# EAGLE design Shield_Play (EAGLE 9.4.0)
COMPANY: Unexpected Maker; DATE: 24-10-2018; DRAWN: Seon; REV: V1; TITLE: TinyPICO
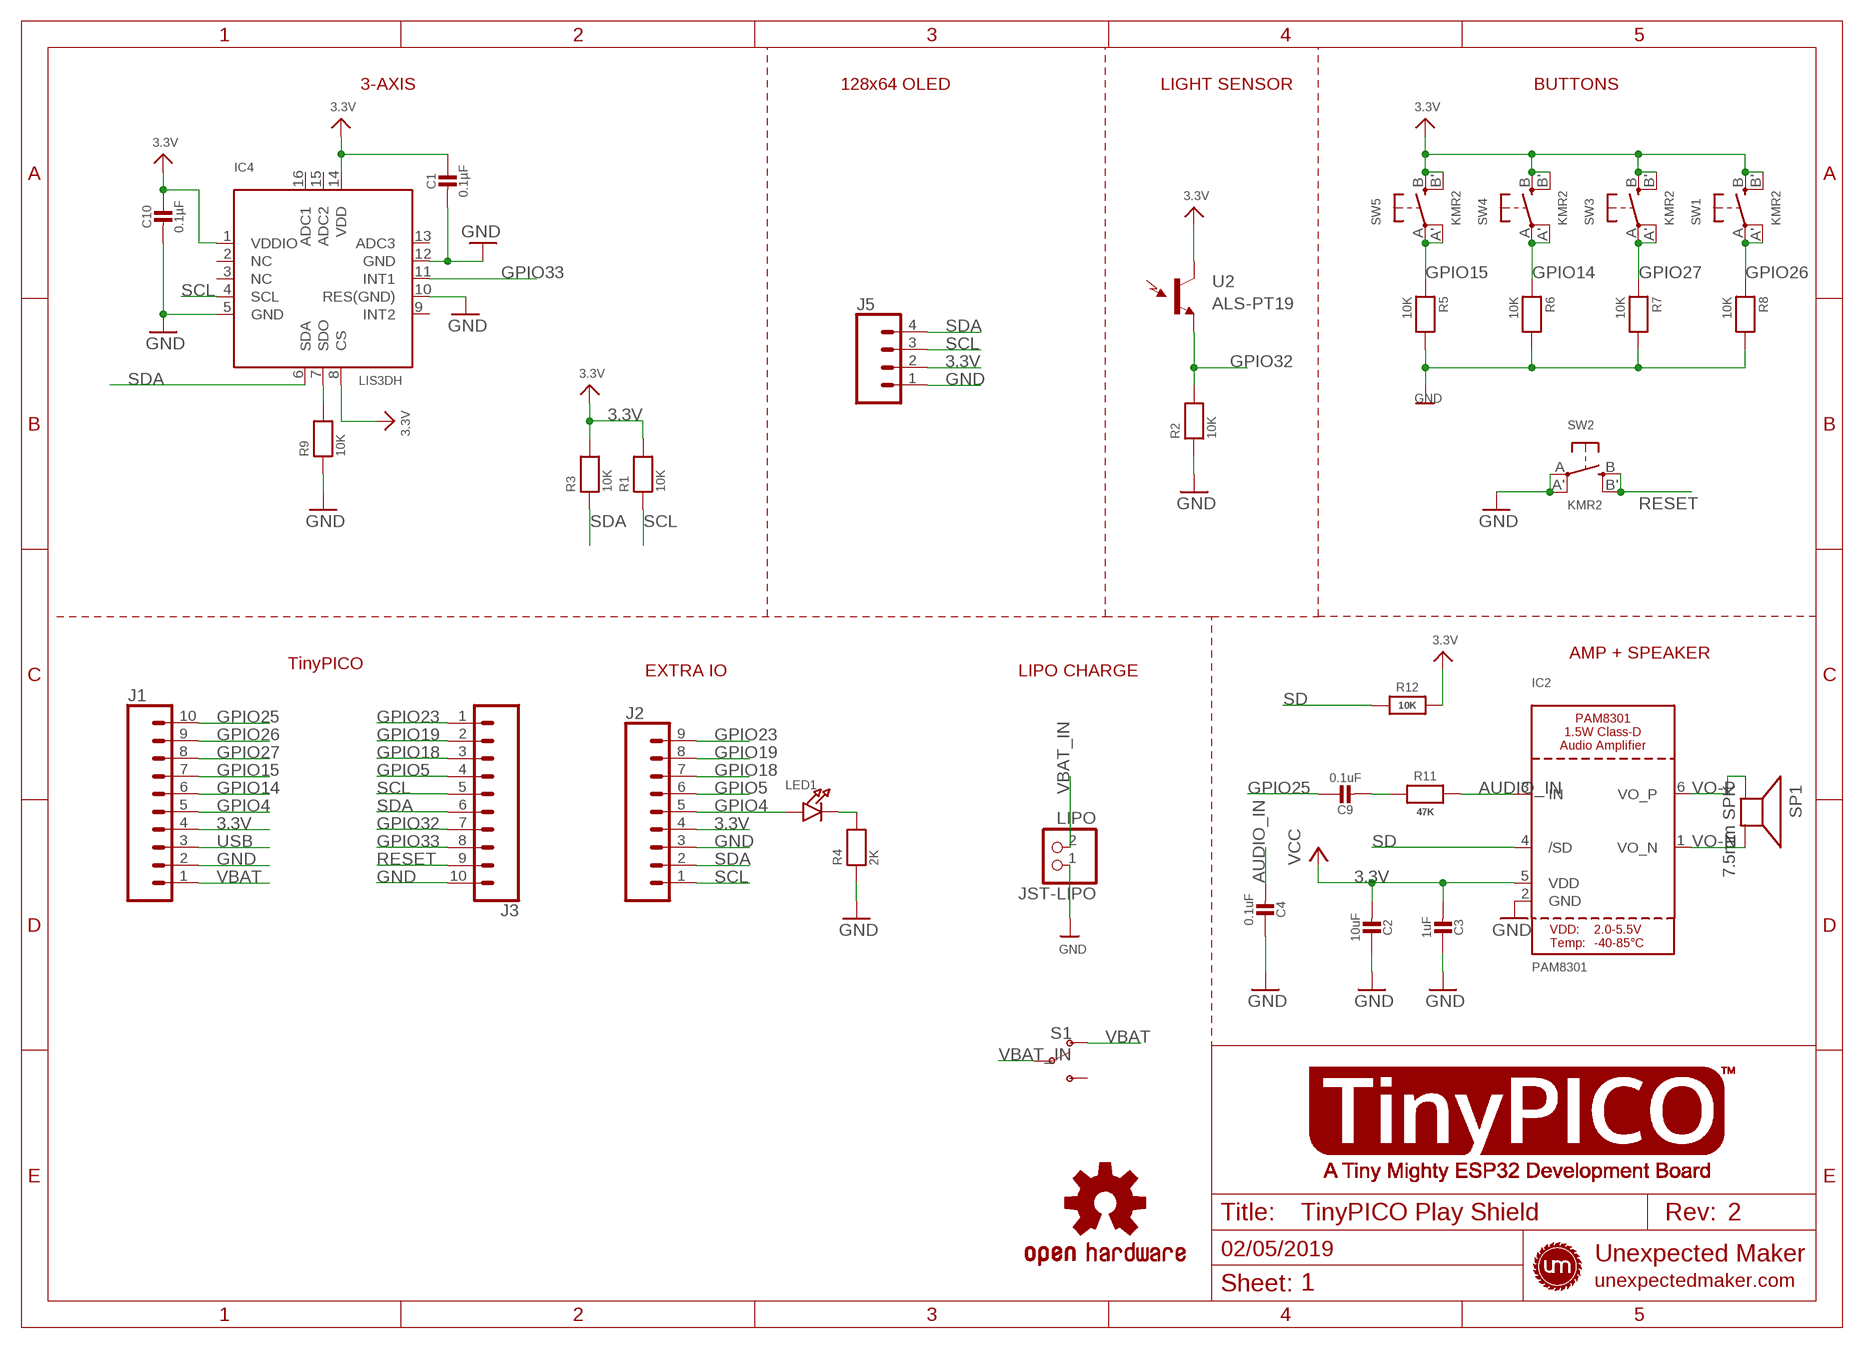
[diagram p0: schematic, sheet 1]
FRAME2 (FRAME_A4_TINYPICO): CDATE: 02/05/2019; REV: 2; SHEET_NUM: 1; TITLE: TinyPICO Play Shield

## Parts
C1  0.1µF  CAP_CERAMIC_0603MP  [_0603MP]
C2  10uF  CAP_CERAMIC_0603MP  [_0603MP]
C3  1uF  CAP_CERAMIC_0603MP  [_0603MP]
C4  0.1uF  CAP_CERAMIC_0603MP  [_0603MP]
C9  0.1uF  CAP_CERAMIC_0603MP  [_0603MP]
C10  0.1µF  CAP_CERAMIC_0603MP  [_0603MP]
IC2  PAM8301  [SOT23-6]
IC4  LIS3DH  ACCEL_LIS3DHTR  [LGA16_3X3MM]
J1  TINYPICO_HEADER_10NO_SILK_PTH_FEMALE  [1X10_NO_SILK]
J2  CONN_09NO_SILK  [1X09_NO_SILK]
J3  TINYPICO_HEADER_10NO_SILK_PTH_FEMALE  [1X10_NO_SILK]
J5  CONN_041X04_NO_SILK  [1X04_NO_SILK]
JST-LIPO  LIPO  JST_2PIN  [JSTPH2]
LED1  LED0603_NOOUTLINE  [CHIPLED_0603_NOOUTLINE]
LOGO1  OSHW-LOGOS  [OSHW-LOGO-S]
R1  10K  RESISTOR_0603MP  [_0603MP]
R2  10K  RESISTOR_0603MP  [_0603MP]
R3  10K  RESISTOR_0603MP  [_0603MP]
R4  2K  RESISTOR_0603MP  [_0603MP]
R5  10K  RESISTOR_0603MP  [_0603MP]
R6  10K  RESISTOR_0603MP  [_0603MP]
R7  10K  RESISTOR_0603MP  [_0603MP]
R8  10K  RESISTOR_0603MP  [_0603MP]
R9  10K  RESISTOR_0603MP  [_0603MP]
R11  47K  RESISTOR_0603MP  [_0603MP]
R12  10K  RESISTOR_0603MP  [_0603MP]
S1  SPARKFUN-SWITCHES_SWITCH-SPDT-SMD-RIGHT-ANGLE  [SPARKFUN-SWITCHES_SWITCH_SPST_SMD_A]
SP1  7.5mm SPK  SPEAKER_7.5MM  [BUZZER_SMT_7.5MM]
SW1  KMR2  SWITCH_TACT_SMT4.6X2.8  [BTN_KMR2_4.6X2.8]
SW2  KMR2  SWITCH_TACT_SMT4.6X2.8  [BTN_KMR2_4.6X2.8]
SW3  KMR2  SWITCH_TACT_SMT4.6X2.8  [BTN_KMR2_4.6X2.8]
SW4  KMR2  SWITCH_TACT_SMT4.6X2.8  [BTN_KMR2_4.6X2.8]
SW5  KMR2  SWITCH_TACT_SMT4.6X2.8  [BTN_KMR2_4.6X2.8]
U2  ALS-PT19  LIGHT_SENSORALS  [ALS-PT19]

## Nets
3.3V: C1.1 C2.2 C3.2 C10.1 IC2.5(VDD) IC4.1(VDDIO) IC4.8(CS) IC4.14(VDD) J1.4 J2.4 J5.2 R1.2 R3.2 R12.2 SW1.B'(S1) SW1.B(S) SW3.B'(S1) SW3.B(S) SW4.B'(S1) SW4.B(S) SW5.B'(S1) SW5.B(S) U2.C(C1) ; supply symbol labelled VCC
AUDIO_IN: C4.2 IC2.3(IN) R11.2
GND: C1.2 C2.1 C3.1 C4.1 C10.2 IC2.2(GND) IC4.5(GND) IC4.10(RES(GND)) IC4.12(GND) J1.2 J2.3 J3.10 J5.1 JST-LIPO.1 R2.1 R4.1 R5.2 R6.2 R7.2 R8.2 R9.1 SW2.A'(P1) SW2.A(P)
GPIO4: J1.5 J2.5 LED1.A
GPIO5: J2.6 J3.4
GPIO14: J1.6 R6.1 SW4.A'(P1) SW4.A(P)
GPIO15: J1.7 R5.1 SW5.A'(P1) SW5.A(P)
GPIO18: J2.7 J3.3
GPIO19: J2.8 J3.2
GPIO23: J2.9 J3.1
GPIO25: C9.1 J1.10
GPIO26: J1.9 R8.1 SW1.A'(P1) SW1.A(P)
GPIO27: J1.8 R7.1 SW3.A'(P1) SW3.A(P)
GPIO32: J3.7 R2.2 U2.E(E1)
GPIO33: IC4.11(INT1) J3.8
N$1: IC4.7(SDO) R9.2
N$2: LED1.C R4.2
N$6: C9.2 R11.1
RESET: J3.9 SW2.B'(S1) SW2.B(S)
SCL: IC4.4(SCL) J2.1 J3.5 J5.3 R1.1
SD: IC2.4(/SD) R12.1
SDA: IC4.6(SDA) J2.2 J3.6 J5.4 R3.1
USB: J1.3
VBAT: J1.1 S1.1(O)
VBAT_IN: JST-LIPO.2 S1.2(P)
VO-N: IC2.1(VO_N) SP1.-
VO-P: IC2.6(VO_P) SP1.+
Unconnected: IC4.2(NC) IC4.3(NC) IC4.9(INT2) IC4.13(ADC3) IC4.15(ADC2) IC4.16(ADC1) S1.3(S)

## Notes on the sheet
- 3-AXIS | 128x64 OLED | LIGHT SENSOR | BUTTONS
- AMP + SPEAKER
- TinyPICO
- EXTRA IO | LIPO CHARGE

## Library data of the parts
C1-C4 C9 C10 = microbuilder:CAP_CERAMIC: Ceramic Capacitors For new designs, use the packages preceded by an '_' character since they are more reliable: The following footprints should be used on most boards: _0402 - Standard footprint for regular board layouts _0603 - Standard footprint for regular board layouts _0805 - Standard footprint for regular board layouts _1206 - Standard footprint for regular board layouts For extremely tight-pitch boards where space is at a premium, the following 'micro-pitch' footprints can be used (smaller pads, no silkscreen outline, etc.): _0402MP - Micro-pitch footprint for very dense/compact boards _0603MP - Micro-pitch footprint for very dense/compact boards _0805MP - Micro-pitch footprint for very dense/compact boards _1206MP - Micro-pitch footprint for very dense/compact boards
IC2 = microbuilder:PAM8301
IC4 = microbuilder:ACCEL_LIS3DHTR: LIS3DHTR 3-Axis Accelerometer with I2C/SPI Interface VDD: 1.71-3.6V VDDIO: 1.71-VDD+0.1V Scale: +/-2g, 4g, 8g, 16g with 16--bit data output Temp:: -40°C - 85°C Mouser: 511-LIS3DHTR Digikey: 497-10613-1-ND
J1 J3 = UnexpectedMaker:TINYPICO_HEADER_10: Multi connection point. Often used as Generic Header-pin footprint for 0.1 inch spaced/style header connections On any of the 0.1 inch spaced packages, you can populate with these: Break Away Headers - Straight <https://www.sparkfun.com/products/116> (PRT-00116) Break Away Male Headers - Right Angle <https://www.sparkfun.com/products/553> (PRT-00553) Female Headers <https://www.sparkfun.com/products/115> (PRT-00115) Break Away Headers - Machine Pin <https://www.sparkfun.com/products/117> (PRT-00117) Break Away Female Headers - Swiss Machine Pin <https://www.sparkfun.com/products/743> (PRT-00743) Arduino Stackable Header - 10 Pin <https://www.sparkfun.com/products/11376> (PRT-11376) For SCREWTERMINALS and SPRING TERMINALS visit here: Screw Terimnals on SparkFun.com <https://www.sparkfun.com/search/results?term=Screw+Terminals> (5mm/3.5mm/2.54mm spacing) This device is also useful as a general connection point to wire up your design to another part of your project. Our various solder wires solder well into these plated through hole pads. Hook-Up Wire - Assortment (Stranded, 22 AWG) <https://www.sparkfun.com/products/11375> (PRT-11375) Hook-Up Wire - Assortment (Solid Core, 22 AWG) <https://www.sparkfun.com/products/11367> (PRT-11367) View the entire wire category on our website here <https://www.sparkfun.com/categories/141> Special notes: Molex polarized connector foot print use with SKU : PRT-08231 with associated crimp pins and housings. 1MM SMD Version SKU: PRT-10208 NOTES ON THE VARIANTS LOCK and LOCK_LONGPADS... This footprint was designed to help hold the alignment of a through-hole component (i.e. 6-pin header) while soldering it into place. You may notice that each hole has been shifted either up or down by 0.005 of an inch from it's more standard position (which is a perfectly straight line). This slight alteration caused the pins (the squares in the middle) to touch the edges of the holes. Because they are alternating, it causes a "brace" to hold the component in place. 0.005 has proven to be the perfect amount of "off-center" position when using our standard breakaway headers. Although looks a little odd when you look at the bare footprint, once you have a header in there, the alteration is very hard to notice. Also,if you push a header all the way into place, it is covered up entirely on the bottom side.; PROD_ID: CONN-11563
J2 = SparkFun-Connectors:CONN_09: Multi connection point. Often used as Generic Header-pin footprint for 0.1 inch spaced/style header connections On any of the 0.1 inch spaced packages, you can populate with these: Break Away Headers - Straight <https://www.sparkfun.com/products/116> (PRT-00116) Break Away Male Headers - Right Angle <https://www.sparkfun.com/products/553> (PRT-00553) Female Headers <https://www.sparkfun.com/products/115> (PRT-00115) Break Away Headers - Machine Pin <https://www.sparkfun.com/products/117> (PRT-00117) Break Away Female Headers - Swiss Machine Pin <https://www.sparkfun.com/products/743> (PRT-00743) For SCREWTERMINALS and SPRING TERMINALS visit here: Screw Terimnals on SparkFun.com <https://www.sparkfun.com/search/results?term=Screw+Terminals> (5mm/3.5mm/2.54mm spacing) This device is also useful as a general connection point to wire up your design to another part of your project. Our various solder wires solder well into these plated through hole pads. Hook-Up Wire - Assortment (Stranded, 22 AWG) <https://www.sparkfun.com/products/11375> (PRT-11375) Hook-Up Wire - Assortment (Solid Core, 22 AWG) <https://www.sparkfun.com/products/11367> (PRT-11367) View the entire wire category on our website here <https://www.sparkfun.com/categories/141> Special notes: Molex polarized connector foot print use with SKU : PRT-08231 with associated crimp pins and housings. 1MM SMD Version SKU: PRT-10208 NOTES ON THE VARIANTS LOCK and LOCK_LONGPADS... This footprint was designed to help hold the alignment of a through-hole component (i.e. 6-pin header) while soldering it into place. You may notice that each hole has been shifted either up or down by 0.005 of an inch from it's more standard position (which is a perfectly straight line). This slight alteration caused the pins (the squares in the middle) to touch the edges of the holes. Because they are alternating, it causes a "brace" to hold the component in place. 0.005 has proven to be the perfect amount of "off-center" position when using our standard breakaway headers. Although looks a little odd when you look at the bare footprint, once you have a header in there, the alteration is very hard to notice. Also,if you push a header all the way into place, it is covered up entirely on the bottom side.
J5 = SparkFun-Connectors:CONN_04: Multi connection point. Often used as Generic Header-pin footprint for 0.1 inch spaced/style header connections On any of the 0.1 inch spaced packages, you can populate with these: Break Away Headers - Straight <https://www.sparkfun.com/products/116> (PRT-00116) Break Away Male Headers - Right Angle <https://www.sparkfun.com/products/553> (PRT-00553) Female Headers <https://www.sparkfun.com/products/115> (PRT-00115) Break Away Headers - Machine Pin <https://www.sparkfun.com/products/117> (PRT-00117) Break Away Female Headers - Swiss Machine Pin <https://www.sparkfun.com/products/743> (PRT-00743) For SCREWTERMINALS and SPRING TERMINALS visit here: Screw Terimnals on SparkFun.com <https://www.sparkfun.com/search/results?term=Screw+Terminals> (5mm/3.5mm/2.54mm spacing) This device is also useful as a general connection point to wire up your design to another part of your project. Our various solder wires solder well into these plated through hole pads. Hook-Up Wire - Assortment (Stranded, 22 AWG) <https://www.sparkfun.com/products/11375> (PRT-11375) Hook-Up Wire - Assortment (Solid Core, 22 AWG) <https://www.sparkfun.com/products/11367> (PRT-11367) View the entire wire category on our website here <https://www.sparkfun.com/categories/141> Special notes: Molex polarized connector foot print use with SKU : PRT-08231 with associated crimp pins and housings. 1MM SMD Version SKU: PRT-10208; PROD_ID: CONN-09696
JST-LIPO = UnexpectedMaker:JST_2PIN: JST 2-Pin Right-Angle Connector PH-Series - 4UConnector: 17311 SH-Series - 4UConnector: 07278
LED1 = microbuilder:LED: LED 0603 - 0603 Surface Mount Package 2mA: Green LED - Low Power (3.9mcd, 2ma, 1.7Vf) - Digikey: 475-2709-2-ND Orange LED - Low Power (9.8mcd, 2ma, 1.8Vf) - Digikey: 475-1194-2-ND Red LED - Low Power (5mcd, 2ma, 1.8Vf) - Digikey: 475-1195-2-ND Yellow LED - Low Power (7mcd, 2ma, 1.8Vf) - Digikey: 475-1196-2-ND 5mA: Blue LED - Low Power (17mcd, 5ma, 2.9Vf) - Digikey: LNJ937W8CRACT-ND 0805 - 0805 Surface Mount Package 2mA: Red LED (8.8mcd, 2mA, 1.8Vf, Clear) - Low Power [Digikey: 475-2510-1-ND] Green LED (5mcd, 2mA, 1.8Vf, Clear) - Low Power [Digikey: 475-2730-1-ND] Yellow LED (11.3mcd, 2mA, 1.8Vf, Clear) - Low Power [Digikey: 475-2555-1-ND] 20mA: Red LED (104mcd, 20mA, Diffused) - LS R976 [Digikey: 475-1278-6-ND] Red LED (12mcd, 20mA, 2.0Vf, Clear) - APT2012EC [Digikey: 754-1128-1-ND] Green LED (15mcd, 20mA, 2.2Vf, Clear) - APT2012GC [Digikey: 754-1131-1-ND] Orange LED (160mcd, 20mA, 2.1Vf, Clear) - APT2012SECK [Digikey: 754-1130-1-ND] 1206 - 1206 Surface Mount Package Green LED (26mcd, 20mA, Diffused) - LG N971 [Digikey: 475-1407-6-ND] Red LED (15mcd, 20mA, Diffused) - LH N974 [Digikey: 475-1416-6-ND]
LOGO1 = SparkFun-Aesthetics:OSHW-LOGO: Open-Source Hardware (OSHW) Logo This logo indicates the piece of hardware it is found on incorporates a OSHW license and/or adheres to the definition of open source hardware found here: http://freedomdefined.org/OSHW
R1-R9 R11 R12 = microbuilder:RESISTOR: Resistors For new designs, use the packages preceded by an '_' character since they are more reliable: The following footprints should be used on most boards: _0402 - Standard footprint for regular board layouts _0603 - Standard footprint for regular board layouts _0805 - Standard footprint for regular board layouts _1206 - Standard footprint for regular board layouts For extremely tight-pitch boards where space is at a premium, the following 'micro-pitch' footprints can be used (smaller pads, no silkscreen outline, etc.): _0402MP - Micro-pitch footprint for very dense/compact boards _0603MP - Micro-pitch footprint for very dense/compact boards _0805MP - Micro-pitch footprint for very dense/compact boards _1206MP - Micro-pitch footprint for very dense/compact boards
S1 = UM_Badge:SPARKFUN-SWITCHES_SWITCH-SPDT: Single Pole, Double Throw (SPDT) Switch Single-pole, double-throw (SPDT) switch. Variant Overview SMD-AYZ0202 Surface Mount DPDT Switch <https://www.sparkfun.com/products/597> (COM-00597) Used on e.g. LilyPad Arduino USB - ATmega32U4 Board <https://www.sparkfun.com/products/12049> PTH-11.6X4.0MM SPDT Mini Power Switch <https://www.sparkfun.com/products/102> (COM-00102) Used on e.g. SparkFun Simon Says - Through-Hole Soldering Kit <https://www.sparkfun.com/products/10547> (KIT-10547) PTH-11.6X4.0MM-KIT KIT version of SPDT Mini Power Switch - Simplifies soldering by removing tStop of switch pins - only one side can be soldered. PTH-11.6X4.0MM-LOCK LOCK version of SPDT Mini Power Switch - Offset pins hold switch in place for easier soldering. SMD-RIGHT-ANGLE Surface Mount Right Angle Switch <https://www.sparkfun.com/products/10860> (COM-10860) Used on e.g. SparkFun ESP8266 Thing <https://www.sparkfun.com/products/13231>; PROD_ID: SWCH-10651; SF_SKU: COM-10860
SP1 = microbuilder:SPEAKER: SPEAKER Source: Buerklin Added PS12 (for part # PS1240 piezo) http://www.ladyada.net/library/pcb/eaglelibrary.html
SW1-SW5 = microbuilder:SWITCH_TACT_SMT: SMT Tact Switches 6x6mm - Digikey: P12940SCT-ND KMR2 (4.6x2.8mm) - Digikey: 401-1426-1-ND EVQ-PQHB55 - Light Touch, 160GF (4.5x4.5mm) - Digikey: P8090SCT-ND KMT0 - KMT021 NGJ LHS (etc.) IP68/Waterproof - Digikey: CKN10289CT-ND
U2 = SparkFun-Sensors:LIGHT_SENSOR: Ambient Light Sensors - Phototransistors Low cost ambient light sensors, consisting of a phototransistor in miniature SMD packages. Output voltage varies with light intensity. SparkFun Products ALS-PT19 Light Sensor <https://www.sparkfun.com/products/12566> (SEN-12566) Ambient Light Sensor - TEMT6000 <https://www.sparkfun.com/products/8348> (SEN-08348) SparkFun Ambient Light Sensor Breakout - TEMT60000 <https://www.sparkfun.com/products/8688> (SEN-08688); PROD_ID: IC-11836; SF_ID: SEN-12566

## Net classes
1 power: width 0.305 mm

## Board
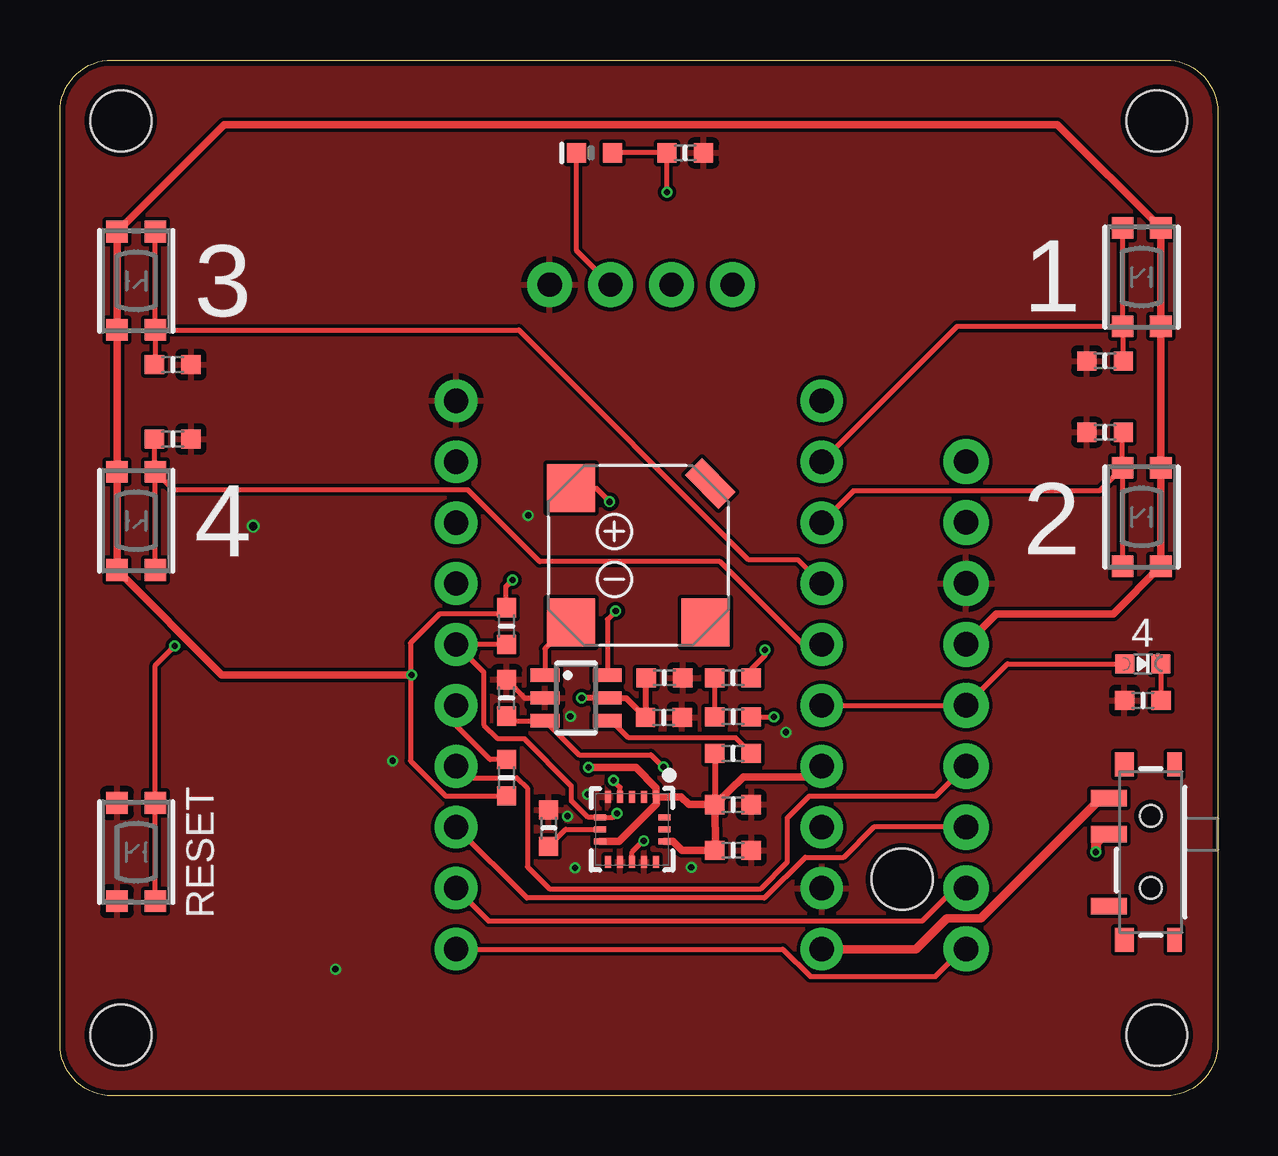
[diagram p1: board, top side]
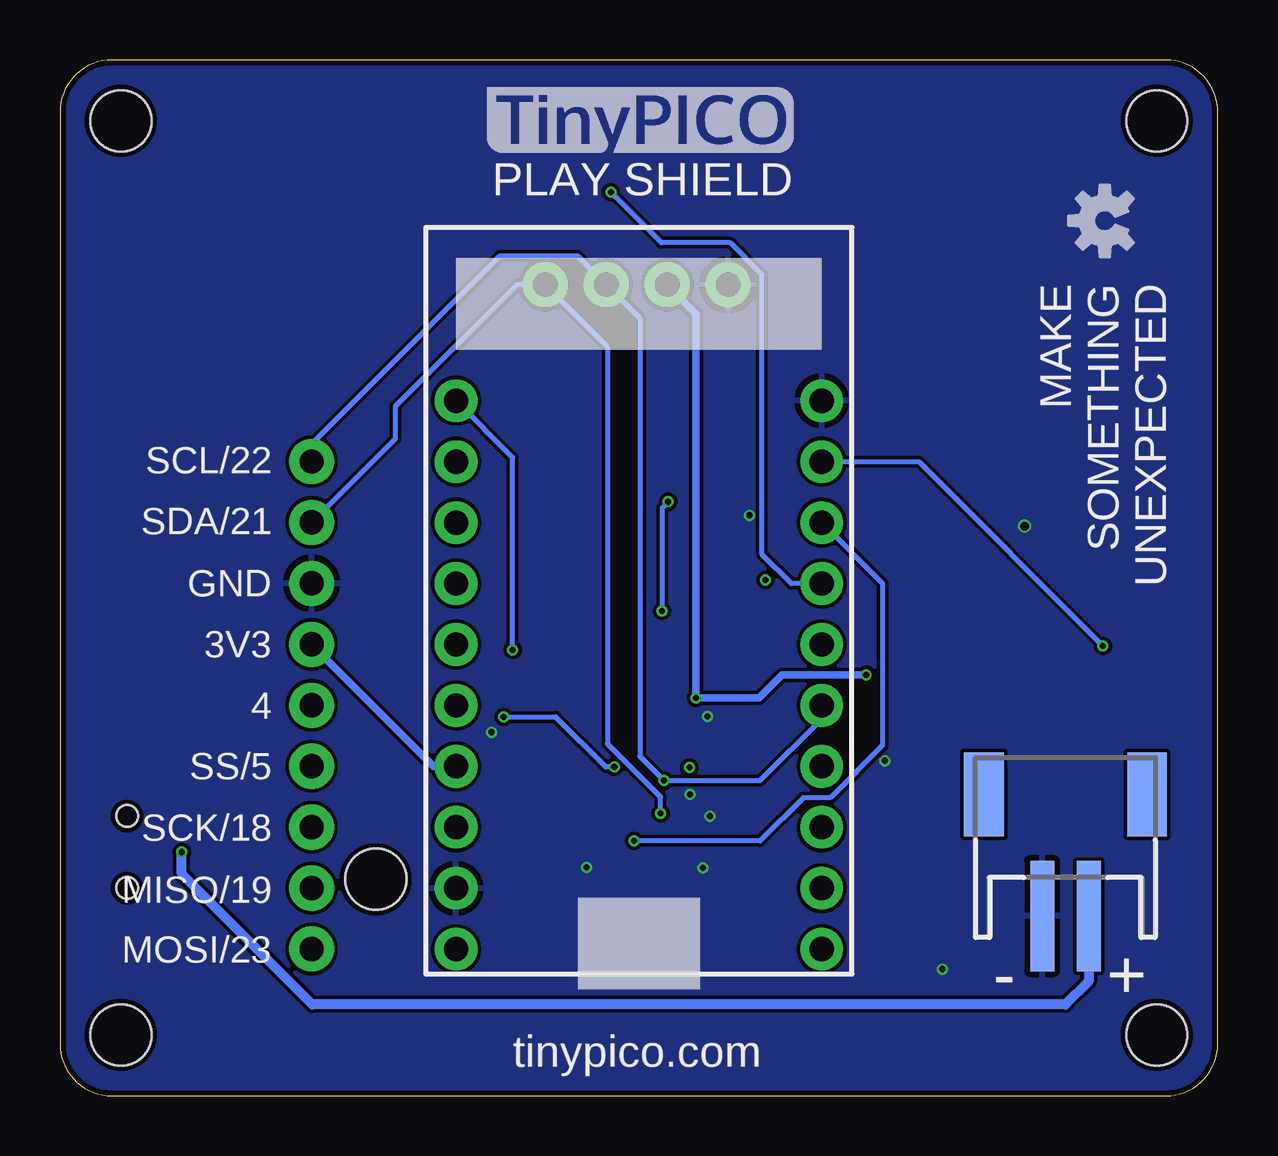
[diagram p2: board, bottom side, seen from below]

Size 48.26 x 43.18 mm. Coordinates in mm from the lower left corner, seen from the top.
Outline: 48.26,41.01 48.26,2.17 arc-90 46.09,0 2.17,0 arc-90 0,2.17 0,41.01 arc-90 2.17,43.18 46.09,43.18 arc-90 48.26,41.01
Copper layers (1*16): Top 0.035mm / dielectric 1.5mm / Bottom 0.035mm
Design rules "UnexpectedMaker_JLCPCB 2 Layer": minimum track width 6mil, minimum drill 10mil, track to track 6mil, track to pad 6mil, pad to pad 6mil, via to via 6mil, smd to smd 6mil, copper to edge 9mil, drill to drill 7mil, minimum pad ring 4mil, minimum via ring 4mil, stop-mask expansion 4mil, vias tented up to drill 25mil, thermal gap 10mil
Holes 2.54 mm at 45.72,2.54 2.54,2.54 2.54,40.64 45.72,40.64 35.1,9.03

### Footprints (pad centres in the part's own frame; a part is rotated, then mirrored left to right if it is on the bottom)
_0603MP = smd 0.8 x 0.8: 1 -0.762,0; 2 0.762,0
SOT23-6 = smd 0.55 x 1.2: 1 -0.95,-1.3; 2 0,-1.3; 3 0.95,-1.3; 4 0.95,1.3; 5 0,1.3; 6 -0.95,1.3
LGA16_3X3MM = smd 0.5 x 0.25: 1 -1.35,1; 2 -1.35,0.5; 3 -1.35,0; 4 -1.35,-0.5; 5 -1.35,-1; 9 1.35,-1; 10 1.35,-0.5; 11 1.35,0; 12 1.35,0.5; 13 1.35,1 | smd 0.25 x 0.5: 6 -0.5,-1.35; 7 0,-1.35; 8 0.5,-1.35; 14 0.5,1.35; 15 0,1.35; 16 -0.5,1.35
1X10_NO_SILK = drill 1.016 pad 1.778: 1 0,0; 2 2.54,0; 3 5.08,0; 4 7.62,0; 5 10.16,0; 6 12.7,0; 7 15.24,0; 8 17.78,0; 9 20.32,0; 10 22.86,0
1X09_NO_SILK = drill 1.016 pad 1.88: 1 0,0; 2 2.54,0; 3 5.08,0; 4 7.62,0; 5 10.16,0; 6 12.7,0; 7 15.24,0; 8 17.78,0; 9 20.32,0
1X04_NO_SILK = drill 1.016 pad 1.88: 1 0,0; 2 2.54,0; 3 5.08,0; 4 7.62,0
JSTPH2 = smd 1 x 4.6: 1 -0.965,-3.607; 2 0.965,-3.607 | smd 1.651 x 3.505: NC1 -3.4,1.473; NC2 3.4,1.473
CHIPLED_0603_NOOUTLINE = smd 0.8 x 0.8: A 0,-0.75; C 0,0.75
SPARKFUN-SWITCHES_SWITCH_SPST_SMD_A = smd 0.7 x 1.5: 1 -2.25,-1.75; 2 -0.75,-1.75; 3 2.25,-1.75 | smd 1 x 0.6: GND1 -3.65,1; GND3 3.65,1 | smd 1 x 0.8: GND2 -3.65,-1.1; GND4 3.65,-1.1 | hole 0.9: -1.5,0; 1.5,0
BUZZER_SMT_7.5MM = smd 2 x 2: + 2.8,-2.8; - 2.8,2.8; MT2 -2.8,2.8 | smd 2 x 1 rotated 135: MT -3,-3
BTN_KMR2_4.6X2.8 = smd 0.9 x 0.9: A 2.05,0.8; A' -2.05,0.8; B 2.05,-0.8; B' -2.05,-0.8
ALS-PT19 = smd 0.8 x 0.8: C -0.75,0; E 0.75,0

### Placement (x,y rotation side)
C1  28.05,12.14 0 top
C2  25.2,17.42 180 top
C3  25.17,15.77 180 top
C4  18.62,16.59 270 top
C9  28.05,17.42 180 top
C10  28.05,10.24 0 top
IC2  21.51,16.59 270 top
IC4  23.85,11.11 270 top
J1  31.75,6.12 90 top
J2  37.77,26.44 270 top
J3  16.51,6.12 90 top
J5  20.41,33.81 0 top
JST-LIPO  6.35,11.1 0 bottom
LED1  45.14,18.01 270 top
LOGO1  4.71,36.48 90 bottom
R1  18.62,13.26 270 top
R2  26.06,39.31 180 top
R3  18.62,19.58 90 top
R4  45.14,16.48 0 top
R5  4.7,30.48 0 top
R6  4.7,27.38 0 top
R7  43.56,27.66 180 top
R8  43.56,30.63 180 top
R9  20.37,11.16 270 top
R11  28.05,15.8 0 top
R12  28.05,14.27 180 top
S1  45.47,10.16 270 top
SP1  24.1,22.53 180 top
SW1  45.09,34.13 90 top
SW2  3.17,10.16 90 top
SW3  45.09,24.13 90 top
SW4  3.17,23.97 270 top
SW5  3.17,33.97 270 top
U2  22.28,39.31 0 top

### Tracks (layer width: path | path; a pad name or v marks a point on that pad's centre or on a via)
3.3V  (via drill 0.25)
  Top 0.203: J5.2 21.53,35.23 U2.C | R1.2 16.08,12.5 14.61,13.97 14.61,17.55 14.61,18.87 15.82,20.09 18.33,20.09 R3.2 18.59,21.24 v18.86,21.5
  Top 0.254: v21.75,16.59 IC2.5 23.6,16.59 C3.2 24.41,17.4 C2.2 | R12.2 C1.1
  Top 0.305: IC4.14 25.56,10.61 25.93,10.24 C10.1 27.32,10.26 C1.1 | IC4.1 25.89,12.47 26.23,12.14 C1.1 | IC4.1 24.86,12.16 23.31,10.61 IC4.8 | J1.4 31.32,13.3 28.5,13.3 C1.1 | IC4.1 24.85,12.84 24.01,13.68 v22.03,13.68 | J2.4 39.04,20.09 43.9,20.09 SW3.B' SW3.B SW1.B' SW1.B 41.58,40.49 6.84,40.49 SW5.B' SW5.B SW4.B' SW4.B 6.75,17.55 14.61,17.55 v14.66,17.55
  Bottom 0.305: J5.2 21.75,32.61 v21.75,16.59 19.13,16.59 18.16,17.55 v14.66,17.55 | J2.4 32.69,13.73 J1.4
AUDIO_IN  (via drill 0.25)
  Top 0.203: v25.15,13.71 v25.14,13.71 24.64,14.22 21.63,14.22 IC2.3 18.78,15.64 C4.2 | R11.2 v29.77,15.8
  Bottom 0.203: v25.15,13.71 25.51,13.71 27.6,15.8 v29.77,15.8
GND  (via drill 0.25, 0.35)
  Top 0.203: C4.1 19.36,16.59 IC2.2
  other vias: 26.31,9.53 11.48,5.28 13.87,13.97 8.05,23.75 19.52,24.2 21.27,15.82 30.26,15.16 22,12.57 21.46,9.5 21.16,11.66
  pour Top: 50.14,43.81 -1.3,43.81 -1.3,-0.63 50.14,-0.63
  pour Bottom: -1.93,-1.27 50.77,-1.27 50.77,44.45 -1.93,44.45
GPIO4
  Top 0.203: LED1.A 39.5,18.01 J2.5 J1.5
GPIO5
  Top 0.203: J2.6 37.75,13.74 36.5,12.49 31.23,12.49 30.32,11.59 30.32,9.75 29.21,8.64 20.4,8.64 19.48,9.55 19.48,12.83 19.05,13.26 16.99,13.26 J3.4
GPIO14
  Top 0.203: SW4.A 3.98,25.88 | 3.98,25.88 SW4.A' 4.74,25.26 17,25.26 19.99,22.27 27.51,22.27 30.96,18.81 J1.6 | R6.1 3.94,25.91 3.98,25.88
GPIO15
  Top 0.203: SW5.A SW5.A' | SW5.A 3.98,30.49 R5.1 | SW5.A 19.12,31.92 28.7,22.35 30.76,22.35 J1.7
GPIO18
  Top 0.203: J3.3 19.46,8.25 29.36,8.25 31.06,9.95 32.67,9.95 33.92,11.2 J2.7
GPIO19
  Top 0.203: J3.2 17.88,7.28 35.94,7.28 37.31,8.66 J2.8
GPIO23
  Top 0.203: J3.1 30.13,6.12 31.28,4.97 36.5,4.97 37.65,6.12 J2.9
GPIO25  (via drill 0.25)
  Top 0.203: v29.39,18.59 29.39,18.36 28.82,17.79 C9.1
  Bottom 0.203: v29.39,18.59 29.39,26.61 J1.10
GPIO26
  Top 0.203: SW1.A SW1.A' | R8.1 44.32,32.04 SW1.A' | J1.9 37.4,32.08 SW1.A'
GPIO27
  Top 0.203: SW3.A SW3.A' | SW3.A 44.28,27.62 R7.1 | J1.8 33.07,25.21 43.32,25.21 SW3.A
GPIO32  (via drill 0.25)
  Top 0.203: U2.E R2.2 v25.3,37.67
  Bottom 0.203: J3.7 17.78,21.36 18.99,22.56 18.99,34.23 20.32,35.56 23.19,35.56 v25.3,37.67
GPIO33  (via drill 0.25)
  Top 0.203: IC4.11 23.85,10.17 24.31,10.63 v24.33,10.63
  Bottom 0.203: v24.33,10.63 19.07,10.63 17.28,12.43 16.15,12.43 13.97,14.61 13.97,21.36 J3.8
N$1
  Top 0.203: R9.2 21.08,11.11 IC4.7
N$2
  Top 0.203: LED1.C 45.89,16.5 R4.2
N$6
  Top 0.203: R11.1 C9.2
RESET  (via drill 0.25)
  Top 0.203: SW2.B' SW2.B 3.98,17.95 v4.79,18.76
  Bottom 0.203: J3.9 12.46,26.43 v4.79,18.76
SCL  (via drill 0.25)
  Top 0.203: IC4.4 23.35,12.87 v23.07,13.14 | R1.1 17.93,14.02 16.51,15.44 J3.5
  Bottom 0.203: J3.5 16.51,15.72 19.09,13.14 v23.07,13.14 24.09,14.16 24.09,32.42 J5.3 25.49,33.83 26.67,35.01 29.93,35.01 37.77,27.17 J2.1
SD
  Top 0.203: IC2.4 23,15.64 23.7,14.93 28.16,14.93 R12.1
SDA  (via drill 0.25)
  Top 0.203: v23.22,11.77 23.06,11.61 IC4.6 22.02,11.61 21.31,12.32 21.31,12.92 19.34,14.89 18.24,14.89 17.66,15.47 17.66,17.66 J3.6 R3.1
  Bottom 0.203: v23.22,11.77 23.22,12.46 25.44,14.68 25.44,31.22 J5.4 29.21,33.81 34.29,28.73 34.29,27.38 J2.2
VBAT
  Top 0.356: J1.1 35.69,6.12 36.96,7.39 38.38,7.39 43.4,12.41 S1.1
VBAT_IN  (via drill 0.25)
  Top 0.406: S1.2 43.51,10.85 43.18,10.52 v43.18,10.16
  Bottom 0.406: v43.18,10.16 43.18,9.25 37.74,3.81 6.35,3.81 5.38,4.78 JST-LIPO.2
VO-N
  Top 0.203: SP1.- 20.21,18.64 IC2.1
VO-P  (via drill 0.25)
  Top 0.203: v22.91,24.77 22.35,25.33 SP1.+ | v23.16,20.21 22.81,19.86 IC2.6
  Bottom 0.203: v22.91,24.77 23.16,24.51 v23.16,20.21

### Text on the board
bPlace: MAKE / SOMETHING / UNEXPECTED | tinypico.com
tNames: 1 | 3 | 2 | 4 | 4 | RESET
bNames: PLAY SHIELD | SCL/22 | SDA/21 | GND | 3V3 | 4 | SS/5 | SCK/18 | MISO/19 | MOSI/23 | + | -